# EAGLE design Sano_LEGO (EAGLE 9.0.0)
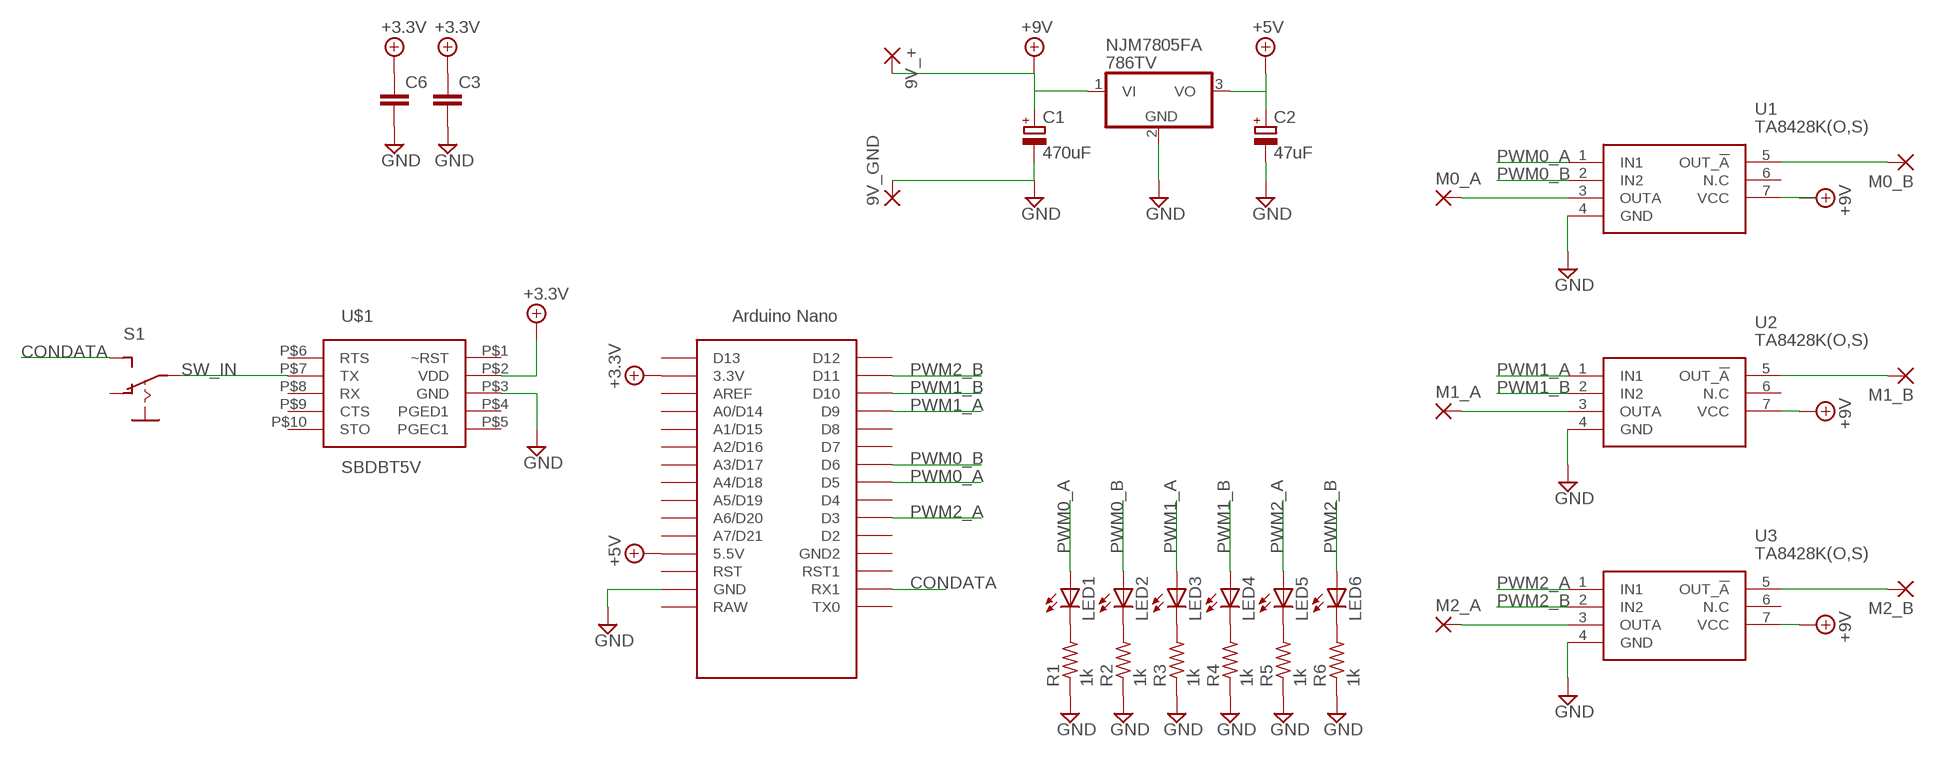
[diagram p0: schematic, sheet 1]

## Parts
9V_+  3,81/1,4  [3,81/1,4]
9V_GND  3,81/1,4  [3,81/1,4]
C1  470uF  CPOL-EUE3.5-10  [E3,5-10]
C2  47uF  CPOL-EUE2-5  [E2-5]
C3  C-EU025-025X050  [C025-025X050]
C6  C-EU025-025X050  [C025-025X050]
LED1  LED3MM  [LED3MM]
LED2  LED3MM  [LED3MM]
LED3  LED3MM  [LED3MM]
LED4  LED3MM  [LED3MM]
LED5  LED3MM  [LED3MM]
LED6  LED3MM  [LED3MM]
M0_A  3,81/1,4  [3,81/1,4]
M0_B  3,81/1,4  [3,81/1,4]
M1_A  3,81/1,4  [3,81/1,4]
M1_B  3,81/1,4  [3,81/1,4]
M2_A  3,81/1,4  [3,81/1,4]
M2_B  3,81/1,4  [3,81/1,4]
NJM7805FA  786TV  [TO220V]
R1  1k  R-US_R1608  [R1608]
R2  1k  R-US_R1608  [R1608]
R3  1k  R-US_R1608  [R1608]
R4  1k  R-US_R1608  [R1608]
R5  1k  R-US_R1608  [R1608]
R6  1k  R-US_R1608  [R1608]
S1  S-SWITCHSMALL  [DS]
U1  TA8428K(O,S)  [HSIP7-P-2.54_1]
U2  TA8428K(O,S)  [HSIP7-P-2.54_1]
U3  TA8428K(O,S)  [HSIP7-P-2.54_1]
U$1  SBDBT5V  [SBDBT]
U$2  NANO  [NANO]

## Nets
+3.3V: C3.1 C6.1 U$1.P$2(VDD) U$2.3.3V
+5V: C2.+ NJM7805FA.3(VO) U$2.5V(5.5V)
+9V: 9V_+.1(P) C1.+ NJM7805FA.1(VI) U1.7(VCC) U2.7(VCC) U3.7(VCC)
CONDATA: S1.P$3(S) U$2.RX1
GND: 9V_GND.1(P) C1.- C2.- C3.2 C6.2 NJM7805FA.2(GND) R1.1 R2.1 R3.1 R4.1 R5.1 R6.1 U1.4(GND) U2.4(GND) U3.4(GND) U$1.P$3(GND) U$2.GND
N$1: LED1.K(C) R1.2
N$2: M0_A.1(P) U1.3(OUTA)
N$3: M0_B.1(P) U1.5(OUT_!A)
N$4: M1_B.1(P) U2.5(OUT_!A)
N$5: M1_A.1(P) U2.3(OUTA)
N$6: M2_B.1(P) U3.5(OUT_!A)
N$7: M2_A.1(P) U3.3(OUTA)
N$8: LED2.K(C) R2.2
N$9: LED3.K(C) R3.2
N$10: LED4.K(C) R4.2
N$11: LED5.K(C) R5.2
N$12: LED6.K(C) R6.2
PWM0_A: LED1.A U1.1(IN1) U$2.D5
PWM0_B: LED2.A U1.2(IN2) U$2.D6
PWM1_A: LED3.A U2.1(IN1) U$2.D9
PWM1_B: LED4.A U2.2(IN2) U$2.D10
PWM2_A: LED5.A U3.1(IN1) U$2.D3
PWM2_B: LED6.A U3.2(IN2) U$2.D11
SW_IN: S1.P$2(P) U$1.P$7(TX)
Unconnected: S1.P$1(O) U1.6(N.C) U2.6(N.C) U3.6(N.C) U$1.P$1(~RST) U$1.P$4(PGED1) U$1.P$5(PGEC1) U$1.P$6(RTS) U$1.P$8(RX) U$1.P$9(CTS) U$1.P$10(STO) U$2.A0(A0/D14) U$2.A1(A1/D15) U$2.A2(A2/D16) U$2.A3(A3/D17) U$2.A4(A4/D18) U$2.A5(A5/D19) U$2.A6(A6/D20) U$2.A7(A7/D21) U$2.AREF U$2.D2 U$2.D4 U$2.D7 U$2.D8 U$2.D12 U$2.D13 U$2.GND1(GND2) U$2.RAW U$2.RST U$2.RST1 U$2.TX0

## Library data of the parts
9V_+ 9V_GND M0_A M0_B M1_A M1_B M2_A M2_B = wirepad:3,81/1,4: THROUGH-HOLE PAD
C1 C2 = rcl:CPOL-EU: POLARIZED CAPACITOR, European symbol
C3 C6 = rcl:C-EU: CAPACITOR, European symbol
LED1-LED6 = LED:LED: LED OSRAM: - CHIPLED LG R971, LG N971, LY N971, LG Q971, LY Q971, LO R971, LY R971 LH N974, LH R974 LS Q976, LO Q976, LY Q976 LO Q996 - Hyper CHIPLED LW Q18S LB Q993, LB Q99A, LB R99A - SideLED LS A670, LO A670, LY A670, LG A670, LP A670 LB A673, LV A673, LT A673, LW A673 LH A674 LY A675 LS A676, LA A676, LO A676, LY A676, LW A676 LS A679, LY A679, LG A679 - Hyper Micro SIDELED® LS Y876, LA Y876, LO Y876, LY Y876 LT Y87S - SmartLED LW L88C, LW L88S LB L89C, LB L89S, LG L890 LS L89K, LO L89K, LY L89K LS L896, LA L896, LO L896, LY L896 - TOPLED LS T670, LO T670, LY T670, LG T670, LP T670 LSG T670, LSP T670, LSY T670, LOP T670, LYG T670 LG T671, LOG T671, LSG T671 LB T673, LV T673, LT T673, LW T673 LH T674 LS T676, LA T676, LO T676, LY T676, LB T676, LH T676, LSB T676, LW T676 LB T67C, LV T67C, LT T67C, LS T67K, LO T67K, LY T67K, LW E67C LS E67B, LA E67B, LO E67B, LY E67B, LB E67C, LV E67C, LT E67C LW T67C LS T679, LY T679, LG T679 LS T770, LO T770, LY T770, LG T770, LP T770 LB T773, LV T773, LT T773, LW T773 LH T774 LS E675, LA E675, LY E675, LS T675 LS T776, LA T776, LO T776, LY T776, LB T776 LHGB T686 LT T68C, LB T68C - Hyper Mini TOPLED® LB M676 - Mini TOPLED Santana® LG M470 LS M47K, LO M47K, LY M47K Source: http://www.osram.convergy.de/
NJM7805FA = linear:78*: Positive VOLTAGE REGULATOR Source: http://cache.national.com/ds/LM/LM78L05.pdf http://www.fairchildsemi.com/ds/LM/LM7805.pdf
R1-R6 = resistor:R-US_: RESISTOR, American symbol
S1 = switch:S-SWITCH: SLIDE SWITCH
U1-U3 = TA8428K(O_S):TA8428K(O,S): Moter Driver,Full Brdg Driver,HSIP7 TA8428K(O,S), Motor Driver, Full Bridge Motor, Maximum of 30 V, 7-Pin SIP Source: Datasheet <https://toshiba.semicon-storage.com/info/docget.jsp?did=8558&prodName=TA8428K>; ARROW_PART_NUMBER: TA8428K(O,S); ARROW_PRICE/STOCK: http://uk.rs-online.com/web/p/products/6939336; DESCRIPTION: Moter Driver,Full Brdg Driver,HSIP7 TA8428K(O,S), Motor Driver, Full Bridge Motor, Maximum of 30 V, 7-Pin SIP; HEIGHT: mm; MANUFACTURER_NAME: Toshiba; MANUFACTURER_PART_NUMBER: TA8428K(O,S); RS_PART_NUMBER: 6939336; RS_PRICE/STOCK: http://uk.rs-online.com/web/p/products/6939336
U$1 = SBDBT:SBDBT5V
U$2 = Arduino-clone:NANO: Arduino Nano

## Board
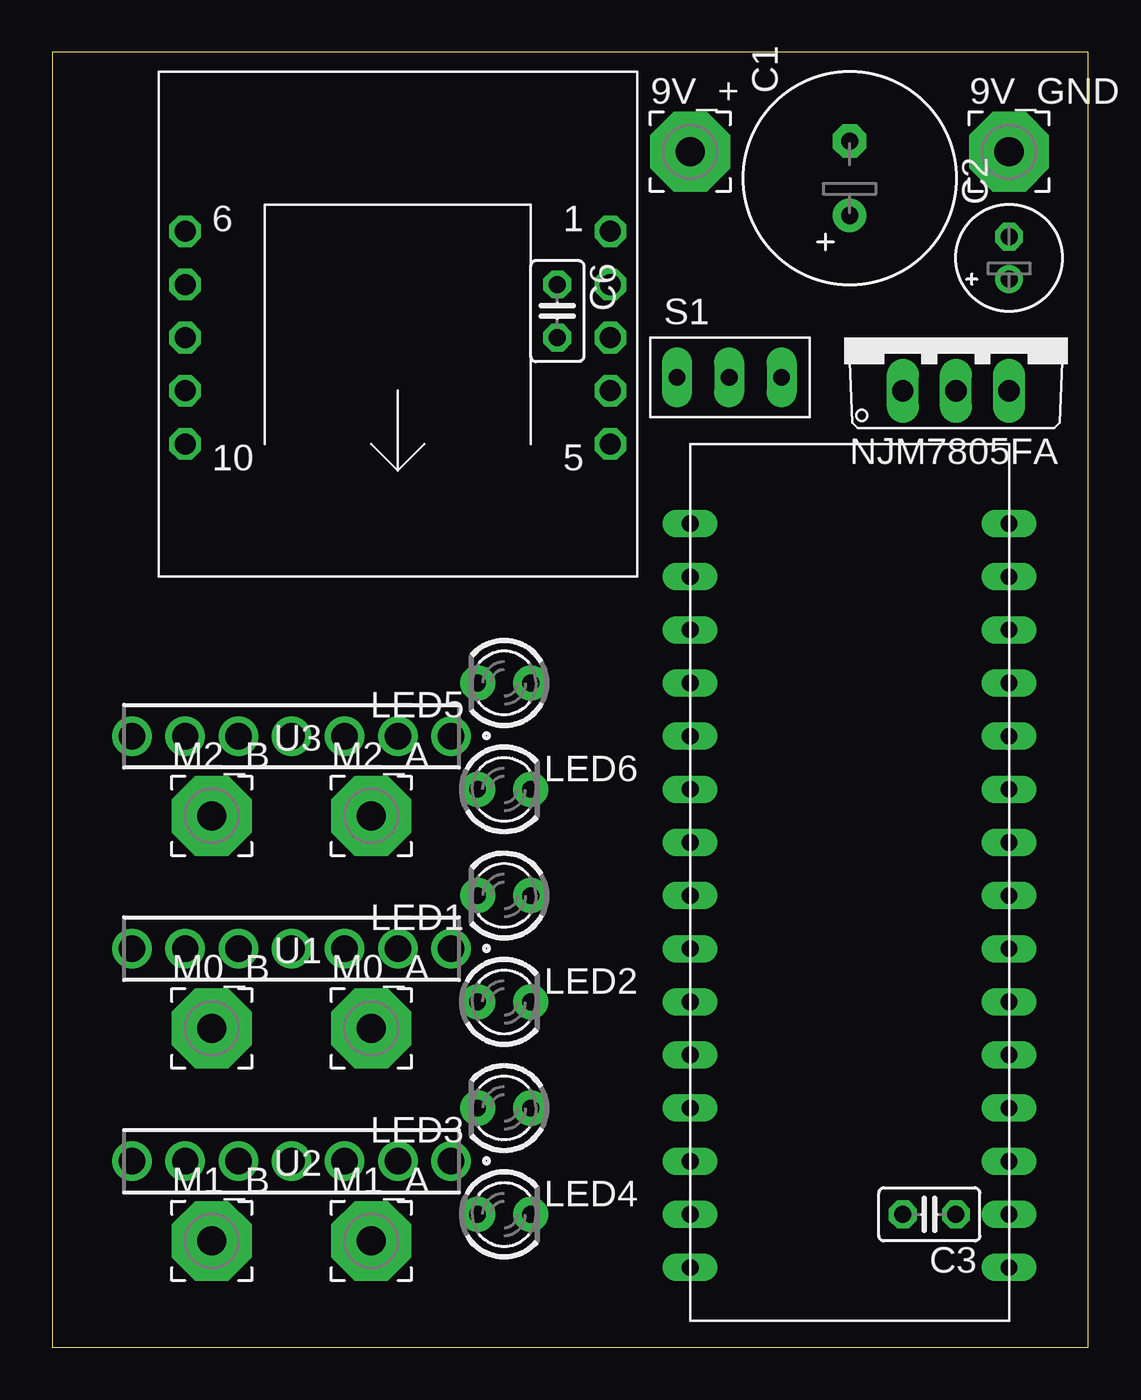
[diagram p1: board, top side]
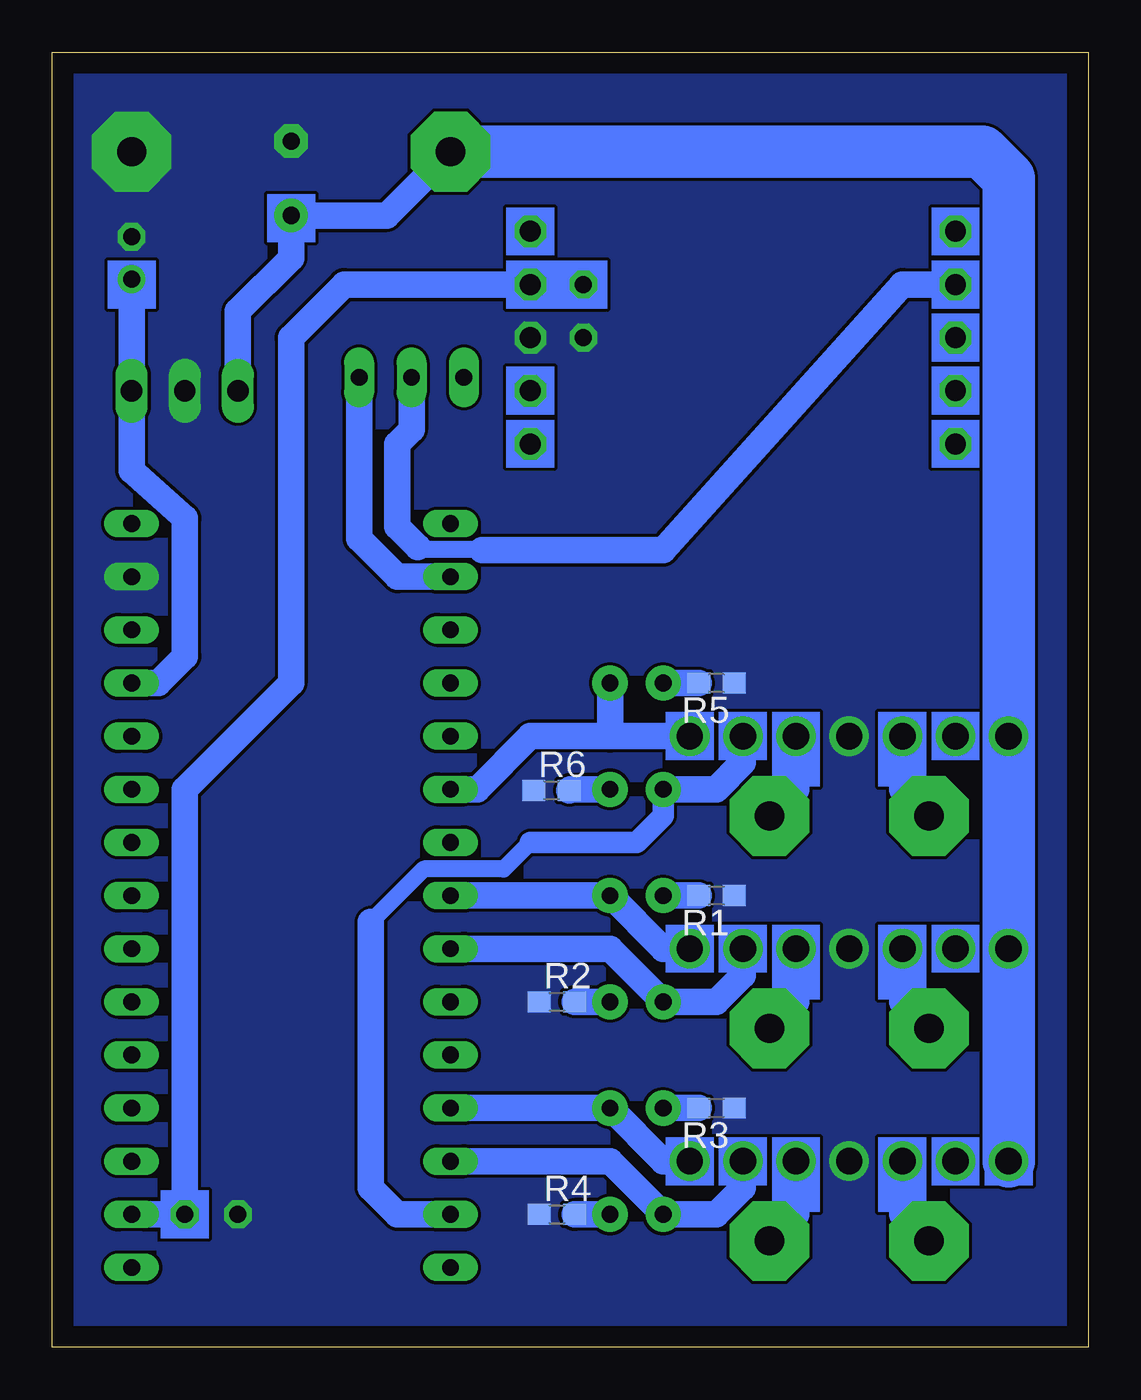
[diagram p2: board, bottom side, seen from below]

Size 49.51 x 61.9 mm. Coordinates in mm from the lower left corner, seen from the top.
Outline: 0,0 49.51,0 49.51,61.9 0,61.9 0,0
Copper layers (1*16): Top 0.035mm / dielectric 1.5mm / Bottom 0.035mm
Design rules "default": minimum track width 6mil, minimum drill 0.35mm, track to track 6mil, track to pad 6mil, pad to pad 6mil, via to via 6mil, smd to smd 6mil, copper to edge 40mil, drill to drill 6mil, minimum pad ring 10mil, minimum via ring 8mil, stop-mask expansion 4mil, vias tented up to drill 0mil, thermal gap 10mil

### Footprints (pad centres in the part's own frame; a part is rotated, then mirrored left to right if it is on the bottom)
3,81/1,4 = drill 1.397 pad 3.81 octagon: 1 0,0
E3,5-10 = drill 0.813 pad 1.6: + -1.778,0 | drill 0.813 pad 1.6 octagon: - 1.778,0
E2-5 = drill 0.813 pad 1.27: + -1.016,0 | drill 0.813 pad 1.27 octagon: - 1.016,0
C025-025X050 = drill 0.813 octagon: 1 -1.27,0; 2 1.27,0
LED3MM = drill 0.8 pad 1.676: A -1.27,0; K 1.27,0
TO220V = drill 1.016 long: 1 -2.54,-2.54; 2 0,-2.54; 3 2.54,-2.54
R1608 = smd 1.1 x 1: 1 -0.85,0; 2 0.85,0
DS = drill 0.8 pad 1.422 long: P$1 0,0; P$2 0,2.5; P$3 0,5
HSIP7-P-2.54_1 = drill 1.26 pad 1.86: 1 -7.62,0; 2 -5.08,0; 3 -2.54,0; 4 0,0; 5 2.54,0; 6 5.08,0; 7 7.62,0
SBDBT = drill 1 octagon: P$1 -10.16,-5.08; P$2 -10.16,-2.54; P$3 -10.16,0; P$4 -10.16,2.54; P$5 -10.16,5.08; P$6 10.16,-5.08; P$7 10.16,-2.54; P$8 10.16,0; P$9 10.16,2.54; P$10 10.16,5.08
NANO = drill 0.8 long: 3.3V -7.62,15.24; 5V -7.62,-10.16; A0 -7.62,10.16; A1 -7.62,7.62; A2 -7.62,5.08; A3 -7.62,2.54; A4 -7.62,0; A5 -7.62,-2.54; A6 -7.62,-5.08; A7 -7.62,-7.62; AREF -7.62,12.7; D2 7.62,-7.62; D3 7.62,-5.08; D4 7.62,-2.54; D5 7.62,0; D6 7.62,2.54; D7 7.62,5.08; D8 7.62,7.62; D9 7.62,10.16; D10 7.62,12.7; D11 7.62,15.24; D12 7.62,17.78; D13 -7.62,17.78; GND -7.62,-15.24; GND1 7.62,-10.16; RAW -7.62,-17.78; RST -7.62,-12.7; RST1 7.62,-12.7; RX1 7.62,-15.24; TX0 7.62,-17.78

### Placement (x,y rotation side)
9V_+  30.48,57.15 0 top
9V_GND  45.72,57.15 0 top
C1  38.1,55.88 90 top
C2  45.72,52.07 90 top
C3  41.91,6.35 180 top
C6  24.13,49.53 270 top
LED1  21.59,21.59 180 top
LED2  21.59,16.51 0 top
LED3  21.59,11.43 180 top
LED4  21.59,6.35 0 top
LED5  21.59,31.75 180 top
LED6  21.59,26.67 0 top
M0_A  15.24,15.24 0 top
M0_B  7.62,15.24 0 top
M1_A  15.24,5.08 0 top
M1_B  7.62,5.08 0 top
M2_A  15.24,25.4 0 top
M2_B  7.62,25.4 0 top
NJM7805FA  43.18,48.26 0 top
R1  17.78,21.59 180 bottom
R2  25.4,16.51 0 bottom
R3  17.78,11.43 180 bottom
R4  25.4,6.35 0 bottom
R5  17.78,31.75 180 bottom
R6  25.65,26.62 0 bottom
S1  29.84,46.35 270 top
U1  11.43,19.05 180 top
U2  11.43,8.89 180 top
U3  11.43,29.21 180 top
U$1  16.51,48.26 180 top
U$2  38.1,21.59 180 top

### Tracks (layer width: path | path; a pad name or v marks a point on that pad's centre or on a via)
+3.3V
  Bottom 1.27: U$2.3.3V C3.1 43.18,26.67 38.1,31.75 38.1,48.26 35.56,50.8 U$1.P$2 C6.1
+5V
  Bottom 1.27: U$2.5V 44.45,31.75 43.18,33.02 43.18,39.62 45.72,41.91 NJM7805FA.3 C2.+
+9V
  Bottom 1.27: NJM7805FA.1 40.64,49.53 38.1,52.07 C1.+ 33.53,54.1 9V_+.1
  Bottom 2.5: U2.7 U1.7 U3.7 3.81,55.88 5.08,57.15 9V_+.1
CONDATA
  Bottom 1.27: U$2.RX1 33.02,36.83 34.84,38.66 S1.P$3
GND
  pour Bottom (no thermals): 0,0 49.53,0 49.53,62.23 0,62.23
N$1
  Bottom 1.27: LED1.K R1.2
N$2
  Bottom 1.27: U1.3 13.97,16.51 M0_A.1
N$3
  Bottom 1.27: U1.5 8.89,16.51 M0_B.1
N$4
  Bottom 1.27: U2.5 8.89,6.35 M1_B.1
N$5
  Bottom 1.27: U2.3 13.97,6.35 M1_A.1
N$6
  Bottom 1.27: U3.5 8.89,26.67 M2_B.1
N$7
  Bottom 1.27: U3.3 13.97,26.67 M2_A.1
N$8
  Bottom 1.27: LED2.K R2.2
N$9
  Bottom 1.27: LED3.K R3.2
N$10
  Bottom 1.27: LED4.K R4.2
N$11
  Bottom 1.27: LED5.K R5.2
N$12
  Bottom 1.27: LED6.K 24.75,26.67 R6.2
PWM0_A
  Bottom 1.27: U1.1 20.32,19.05 LED1.A U$2.D5
PWM0_B
  Bottom 1.27: U1.2 16.51,17.78 17.78,16.51 LED2.A 22.86,19.05 U$2.D6
PWM1_A
  Bottom 1.27: U$2.D9 LED3.A 20.32,8.89 U2.1
PWM1_B
  Bottom 1.27: U2.2 16.51,7.62 17.78,6.35 LED4.A 22.86,8.89 U$2.D10
PWM2_A
  Bottom 1.27: U3.1 22.86,29.21 | 22.86,29.21 26.67,29.21 29.21,26.67 U$2.D3 | LED5.A 22.86,29.21
PWM2_B
  Bottom 0.813: 34.29,20.32 31.75,22.86 27.94,22.86 26.67,24.13
  Bottom 1.016: LED6.A 20.32,25.4 21.59,24.13 26.67,24.13
  Bottom 1.27: 34.29,20.32 34.29,7.62 33.02,6.35 U$2.D11 | LED6.A 17.78,26.67 16.51,27.94 U3.2
SW_IN
  Bottom 0.813: 28.96,38.1 29.27,38.16 31.96,38.16 32.05,38.25
  Bottom 1.27: S1.P$2 32.34,43.85 33.02,43.18 33.02,39.22 32.05,38.25 | 28.96,38.1 20.32,38.1 8.89,50.8 U$1.P$7
(copper drawn outside any net)
  shapes: Bottom area x38